# EasyEDA Pro project Rain_Sensor.epro, schematic Schematic1
Board Name: Board1; Create Date: 2024-11-02; Page Name: P1; Project Name: wenglor2024; Schematic Name: Schematic1; Update Date: 2024-12-02; Company: EasyEDA.com; Drawn: EasyEDA; Page Size: A4; Part Number: JLCPCB-002; Reviewed: EasyEDA; Version: V0.1
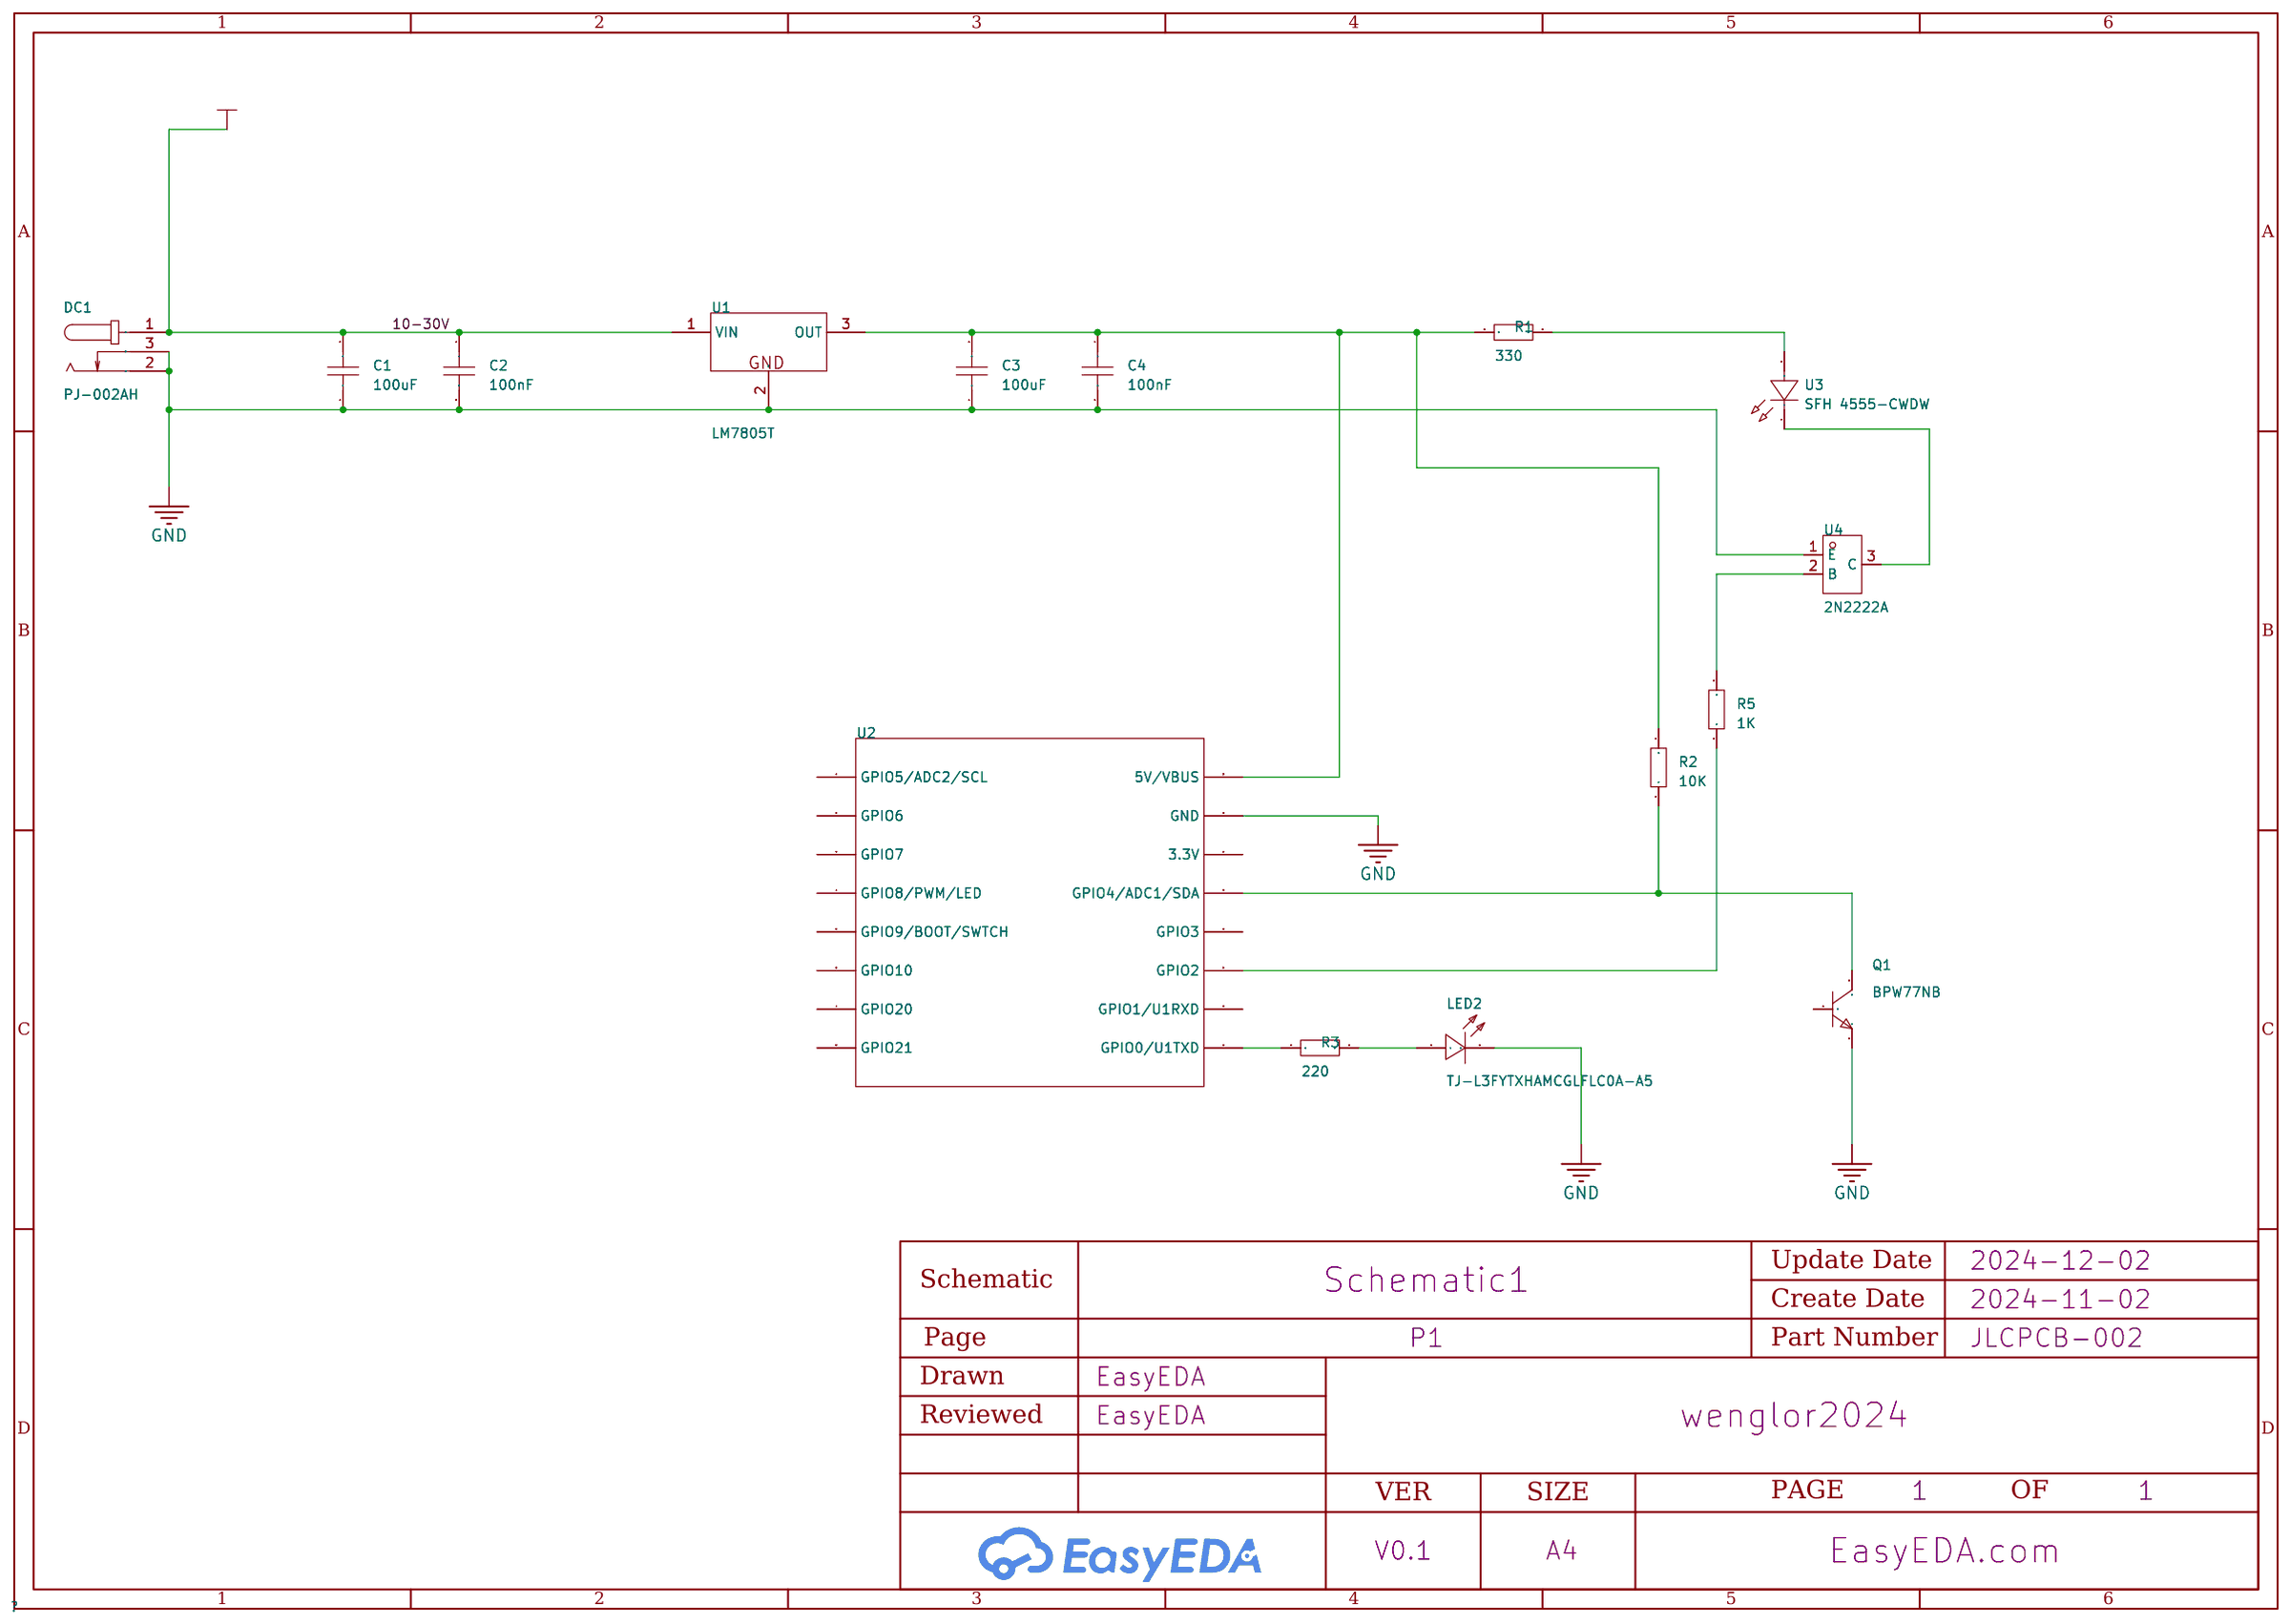
[diagram p0: schematic sheet]

## Parts
C1  100uF  [C0603]
C2  100nF  [C0603]
C3  100uF  [C0603]
C4  100nF  [C0603]
DC1  PJ-002AH  [DC-IN-TH_PJ-002AH]
LED2  TJ-L3FYTXHAMCGLFLC0A-A5  [LED-TH_BD3.0-P2.54-FD]
Q1  BPW77NB  [TO-18-3]
R1  330  [R0603]
R2  10K  [R0603]
R3  220  [R0603]
R5  1K  [R0603]
U1  LM7805T  [TO-220-3_L10.0-W4.5-P2.54-L]
U2  -  [ESP32-C3-SUPER-MINI]
U3  SFH 4555-CWDW  [LED-TH_BD5.8-P2.54-RD]
U4  2N2222A  [TO-18-3_BD5.6_L14C1]

## Library data of the parts
C1-C4 = CAP_0603: Supplier Footprint: 0603
DC1 = PJ-002AH: Supplier Part: C2961147; Manufacturer: CUI; Supplier Footprint: 插件; JLCPCB Part Class: Extended Part; Datasheet: https://atta.szlcsc.com/upload/public/pdf/source/20240521/A08913D28BE33A05CA20666EF8336D3A.pdf; Supplier: LCSC
LED2 = TJ-L3FYTXHAMCGLFLC0A-A5: Lamp Holder Type:3mm round bulb Emitted Color:Orange Forward Current:20mA Lens Color:Frosted Orange Lens Viewing Angle:45° Operating Temperature:-20℃~+80℃ Operating Temperature:-20℃~+80℃; LCSC Part Name: 橙灯; Supplier Part: C330758; Manufacturer: TOGIALED(统佳); Supplier Footprint: 插件,D=3mm; JLCPCB Part Class: Extended Part; Datasheet: https://atta.szlcsc.com/upload/public/pdf/source/20200630/C330758_4D45038C78DDB483BDC1D97AAE81DE0C.pdf; Supplier: LCSC; Lamp Holder Type: 3mm round bulb; Emitted Color: Orange; Forward Current: 20mA; Lens Color: Frosted Orange Lens; Viewing Angle: 45°; Operating Temperature: -20℃~+80℃
Q1 = BPW77NB: Collector Emitter Voltage:70V Collector Emitter Voltage:70V Collector Current (Ic):50mA Dissipation Power(Max):250mW Collector Dark Current:100nA Peak Wavelength:850nm Viewing Angle:- Operating Temperature:-40℃~+125℃ Operating Temperature:-40℃~+125℃; Supplier Part: C3008910; Manufacturer: VISHAY(威世); Supplier Footprint: TO-18; JLCPCB Part Class: Extended Part; Datasheet: https://atta.szlcsc.com/upload/public/pdf/source/20220608/7E91363C0358F046F05E77AE6D0ECEB6.pdf; Supplier: LCSC; Collector Emitter Voltage: 70V; Collector Current (Ic): 50mA; Dissipation Power(Max): 250mW; Collector Dark Current: 100nA; Peak Wavelength: 850nm; Operating Temperature: -40℃~+125℃
R1-R3 R5 = Res_0603: Supplier Footprint: 0603
U1 = LM7805T: Output Type:-; LCSC Part Name: 固定电压稳压器; Supplier Part: C507145; Manufacturer: HGC(华冠); Supplier Footprint: TO-220; JLCPCB Part Class: Extended Part; Datasheet: https://atta.szlcsc.com/upload/public/pdf/source/20200407/C507145_1DA72BA5F895750ED399660AFF328D09.pdf; Supplier: LCSC
U2 = ESP32-C3-SUPER-MINI
U3 = SFH 4555-CWDW: Vf - Forward Voltage:1.5V Vf - Forward Voltage:1.5V Wavelength:860nm Wavelength:860nm Radiant Intensity:55mW/sr@70mA View Angle:10° Operating Temperature:-40℃~+100℃ Operating Temperature:-40℃~+100℃; LCSC Part Name: 光电二极管; Supplier Part: C2900383; Manufacturer: OSRAM(欧司朗); Supplier Footprint: 插件; JLCPCB Part Class: Extended Part; Datasheet: https://atta.szlcsc.com/upload/public/pdf/source/20240116/9F0D54917D4EDC78699C30043A64AF37.pdf; Supplier: LCSC; Vf - Forward Voltage: 1.5V; Wavelength: 860nm; Radiant Intensity: 55mW/sr@70mA; View Angle: 10°; Operating Temperature: -40℃~+100℃
